# EAGLE design FeatherProto-V2.0 (EAGLE 7.4.0)
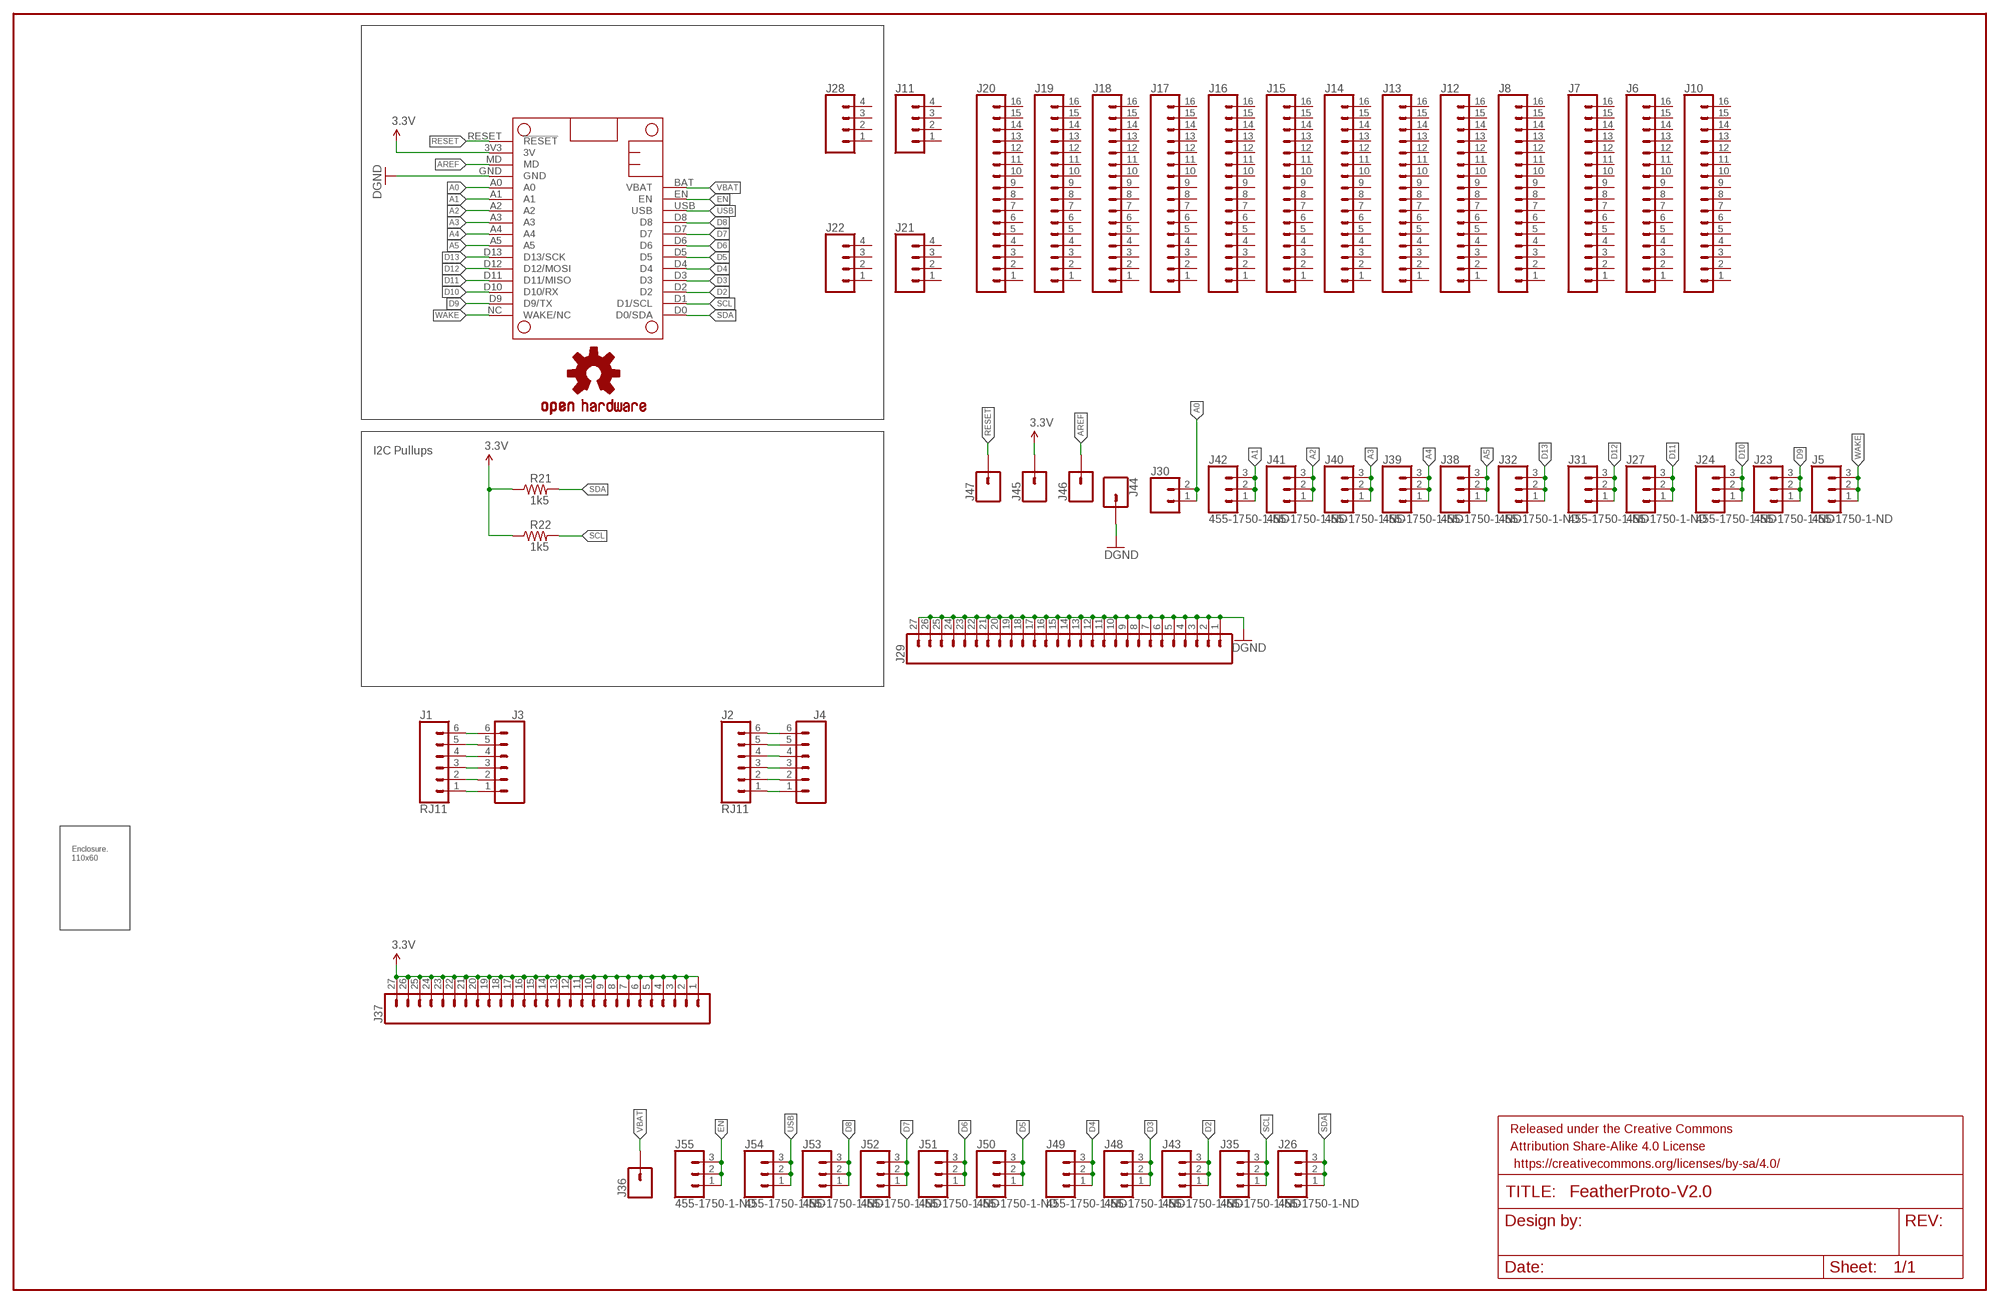
[diagram p0: schematic, sheet 1]

## Parts
FRAME2  FRAME-LEDGER  [CREATIVE_COMMONS]
J1  RJ11  RJ11-6  [RJ11-6]
J2  RJ11  RJ11-6  [RJ11-6]
J3  CONN_06SILK_FEMALE_PTH  [1X06]
J4  CONN_06SILK_FEMALE_PTH  [1X06]
J5  455-1750-1-ND  CONN_03  [1X03]
J6  CONN_161X16_NO_SILK  [1X16_NO_SILK]
J7  CONN_161X16_NO_SILK  [1X16_NO_SILK]
J8  CONN_161X16_NO_SILK  [1X16_NO_SILK]
J10  CONN_161X16_NO_SILK  [1X16_NO_SILK]
J11  CONN_041X04_NO_SILK  [1X04_NO_SILK]
J12  CONN_161X16_NO_SILK  [1X16_NO_SILK]
J13  CONN_161X16_NO_SILK  [1X16_NO_SILK]
J14  CONN_161X16_NO_SILK  [1X16_NO_SILK]
J15  CONN_161X16_NO_SILK  [1X16_NO_SILK]
J16  CONN_161X16_NO_SILK  [1X16_NO_SILK]
J17  CONN_161X16_NO_SILK  [1X16_NO_SILK]
J18  CONN_161X16_NO_SILK  [1X16_NO_SILK]
J19  CONN_161X16_NO_SILK  [1X16_NO_SILK]
J20  CONN_161X16_NO_SILK  [1X16_NO_SILK]
J21  CONN_041X04_NO_SILK  [1X04_NO_SILK]
J22  CONN_041X04_NO_SILK  [1X04_NO_SILK]
J23  455-1750-1-ND  CONN_03  [1X03]
J24  455-1750-1-ND  CONN_03  [1X03]
J26  455-1750-1-ND  CONN_03  [1X03]
J27  455-1750-1-ND  CONN_03  [1X03]
J28  CONN_041X04_NO_SILK  [1X04_NO_SILK]
J29  CONN_27  [1X27]
J30  CONN_02  [1X02]
J31  455-1750-1-ND  CONN_03  [1X03]
J32  455-1750-1-ND  CONN_03  [1X03]
J35  455-1750-1-ND  CONN_03  [1X03]
J36  CONN_01PTH_NO_SILK_YES_STOP  [1X01_NO_SILK]
J37  CONN_27  [1X27]
J38  455-1750-1-ND  CONN_03  [1X03]
J39  455-1750-1-ND  CONN_03  [1X03]
J40  455-1750-1-ND  CONN_03  [1X03]
J41  455-1750-1-ND  CONN_03  [1X03]
J42  455-1750-1-ND  CONN_03  [1X03]
J43  455-1750-1-ND  CONN_03  [1X03]
J44  CONN_01PTH_NO_SILK_YES_STOP  [1X01_NO_SILK]
J45  CONN_01PTH_NO_SILK_YES_STOP  [1X01_NO_SILK]
J46  CONN_01PTH_NO_SILK_YES_STOP  [1X01_NO_SILK]
J47  CONN_01PTH_NO_SILK_YES_STOP  [1X01_NO_SILK]
J48  455-1750-1-ND  CONN_03  [1X03]
J49  455-1750-1-ND  CONN_03  [1X03]
J50  455-1750-1-ND  CONN_03  [1X03]
J51  455-1750-1-ND  CONN_03  [1X03]
J52  455-1750-1-ND  CONN_03  [1X03]
J53  455-1750-1-ND  CONN_03  [1X03]
J54  455-1750-1-ND  CONN_03  [1X03]
J55  455-1750-1-ND  CONN_03  [1X03]
LOGO1  OSHW-LOGOM  [OSHW-LOGO-M]
MS1  XENONA  [XENON_BREAKOUT_A]
R21  1k5  RESISTOR0805  [0805]
R22  1k5  RESISTOR0805  [0805]
U$1  CAMDENBOSS-ENCLOSURE-110X60BOTH-EXTENDED-WIDE  [CAMDENBOSS_ENCLOSURE_110X60_WIDE_EXTENDED]

## Nets
3.3V: J37.1 J37.2 J37.3 J37.4 J37.5 J37.6 J37.7 J37.8 J37.9 J37.10 J37.11 J37.12 J37.13 J37.14 J37.15 J37.16 J37.17 J37.18 J37.19 J37.20 J37.21 J37.22 J37.23 J37.24 J37.25 J37.26 J37.27 J45.1 MS1.3V3(3V) R21.1 R22.1
A0: J30.1 J30.2 MS1.A0
A1: J42.1 J42.2 J42.3 MS1.A1
A2: J41.1 J41.2 J41.3 MS1.A2
A3: J40.1 J40.2 J40.3 MS1.A3
A4: J39.1 J39.2 J39.3 MS1.A4
A5: J38.1 J38.2 J38.3 MS1.A5
AREF: J46.1 MS1.MD
D2: J43.1 J43.2 J43.3 MS1.D2
D3: J48.1 J48.2 J48.3 MS1.D3
D4: J49.1 J49.2 J49.3 MS1.D4
D5: J50.1 J50.2 J50.3 MS1.D5
D6: J51.1 J51.2 J51.3 MS1.D6
D7: J52.1 J52.2 J52.3 MS1.D7
D8: J53.1 J53.2 J53.3 MS1.D8
D9: J23.1 J23.2 J23.3 MS1.D9(D9/TX)
D10: J24.1 J24.2 J24.3 MS1.D10(D10/RX)
D11: J27.1 J27.2 J27.3 MS1.D11(D11/MISO)
D12: J31.1 J31.2 J31.3 MS1.D12(D12/MOSI)
D13: J32.1 J32.2 J32.3 MS1.D13(D13/SCK)
EN: J55.1 J55.2 J55.3 MS1.EN
GND: J29.1 J29.2 J29.3 J29.4 J29.5 J29.6 J29.7 J29.8 J29.9 J29.10 J29.11 J29.12 J29.13 J29.14 J29.15 J29.16 J29.17 J29.18 J29.19 J29.20 J29.21 J29.22 J29.23 J29.24 J29.25 J29.26 J29.27 J44.1 MS1.GND ; supply symbol labelled DGND
N$1: J1.6 J3.6
N$3: J1.5 J3.5
N$4: J1.4 J3.4
N$6: J1.3 J3.3
N$7: J1.2 J3.2
N$11: J1.1 J3.1
N$12: J2.1 J4.1
N$13: J2.2 J4.2
N$15: J2.3 J4.3
N$16: J2.4 J4.4
N$19: J2.5 J4.5
N$20: J2.6 J4.6
RESET: J47.1 MS1.RESET(!RESET)
SCL: J35.1 J35.2 J35.3 MS1.D1(D1/SCL) R22.2
SDA: J26.1 J26.2 J26.3 MS1.D0(D0/SDA) R21.2
USB: J54.1 J54.2 J54.3 MS1.USB
VBAT: J36.1 MS1.BAT(VBAT)
WAKE: J5.1 J5.2 J5.3 MS1.NC(WAKE/NC)
Unconnected: J6.1 J6.2 J6.3 J6.4 J6.5 J6.6 J6.7 J6.8 J6.9 J6.10 J6.11 J6.12 J6.13 J6.14 J6.15 J6.16 J7.1 J7.2 J7.3 J7.4 J7.5 J7.6 J7.7 J7.8 J7.9 J7.10 J7.11 J7.12 J7.13 J7.14 J7.15 J7.16 J8.1 J8.2 J8.3 J8.4 J8.5 J8.6 J8.7 J8.8 J8.9 J8.10 J8.11 J8.12 J8.13 J8.14 J8.15 J8.16 J10.1 J10.2 J10.3 J10.4 J10.5 J10.6 J10.7 J10.8 J10.9 J10.10 J10.11 J10.12 J10.13 J10.14 J10.15 J10.16 J11.1 J11.2 J11.3 J11.4 J12.1 J12.2 J12.3 J12.4 J12.5 J12.6 J12.7 J12.8 J12.9 J12.10 J12.11 J12.12 J12.13 J12.14 J12.15 J12.16 J13.1 J13.2 J13.3 J13.4 J13.5 J13.6 J13.7 J13.8 J13.9 J13.10 J13.11 J13.12 J13.13 J13.14 J13.15 J13.16 J14.1 J14.2 J14.3 J14.4 J14.5 J14.6 J14.7 J14.8 J14.9 J14.10 J14.11 J14.12 J14.13 J14.14 J14.15 J14.16 J15.1 J15.2 J15.3 J15.4 J15.5 J15.6 J15.7 J15.8 J15.9 J15.10 J15.11 J15.12 J15.13 J15.14 J15.15 J15.16 J16.1 J16.2 J16.3 J16.4 J16.5 J16.6 J16.7 J16.8 J16.9 J16.10 J16.11 J16.12 J16.13 J16.14 J16.15 J16.16 J17.1 J17.2 J17.3 J17.4 J17.5 J17.6 J17.7 J17.8 J17.9 J17.10 J17.11 J17.12 J17.13 J17.14 J17.15 J17.16 J18.1 J18.2 J18.3 J18.4 J18.5 J18.6 J18.7 J18.8 J18.9 J18.10 J18.11 J18.12 J18.13 J18.14 J18.15 J18.16 J19.1 J19.2 J19.3 J19.4 J19.5 J19.6 J19.7 J19.8 J19.9 J19.10 J19.11 J19.12 J19.13 J19.14 J19.15 J19.16 J20.1 J20.2 J20.3 J20.4 J20.5 J20.6 J20.7 J20.8 J20.9 J20.10 J20.11 J20.12 J20.13 J20.14 J20.15 J20.16 J21.1 J21.2 J21.3 J21.4 J22.1 J22.2 J22.3 J22.4 J28.1 J28.2 J28.3 J28.4

## Notes on the sheet
- I2C Pullups

## Library data of the parts
FRAME2 = SparkFun-Aesthetics:FRAME-LEDGER: Schematic Frame Standard 11x14 US Ledger frame
J1 J2 = SparkFun-Connectors:RJ11-6: RJ11 Jack - 6 pin Commonly found on CAT3 devices and some Microchip programmers. Here is the connector we sell at SparkFun: RJ11 6-Pin Connector <https://www.sparkfun.com/products/132> (PRT-00132) Datasheet <http://www.sparkfun.com/datasheets/Prototyping/Connectors/RJ11-Datasheet.pdf> It is used on this SparkFun product: SparkFun Weather Shield <https://www.sparkfun.com/products/12081> (DEV-12081) Weather Meters <https://www.sparkfun.com/products/8942> (SEN-08942); PROD_ID: CONN-08590; SF_ID: PRT-00132
J3 J4 = SparkFun-Connectors:CONN_06: Multi connection point. Often used as Generic Header-pin footprint for 0.1 inch spaced/style header connections On any of the 0.1 inch spaced packages, you can populate with these: Break Away Headers - Straight <https://www.sparkfun.com/products/116> (PRT-00116) Break Away Male Headers - Right Angle <https://www.sparkfun.com/products/553> (PRT-00553) Female Headers <https://www.sparkfun.com/products/115> (PRT-00115) Break Away Headers - Machine Pin <https://www.sparkfun.com/products/117> (PRT-00117) Break Away Female Headers - Swiss Machine Pin <https://www.sparkfun.com/products/743> (PRT-00743) Arduino Stackable Header - 6 Pin <https://www.sparkfun.com/products/9280> (PRT-09280) For SCREWTERMINALS and SPRING TERMINALS visit here: Screw Terimnals on SparkFun.com <https://www.sparkfun.com/search/results?term=Screw+Terminals> (5mm/3.5mm/2.54mm spacing) This device is also useful as a general connection point to wire up your design to another part of your project. Our various solder wires solder well into these plated through hole pads. Hook-Up Wire - Assortment (Stranded, 22 AWG) <https://www.sparkfun.com/products/11375> (PRT-11375) Hook-Up Wire - Assortment (Solid Core, 22 AWG) <https://www.sparkfun.com/products/11367> (PRT-11367) View the entire wire category on our website here <https://www.sparkfun.com/categories/141>; PROD_ID: CONN-08437
J5 J23 J24 J26 J27 J31 J32 J35 J38-J43 J48-J55 = SparkFun-Connectors:CONN_03: Multi connection point. Often used as Generic Header-pin footprint for 0.1 inch spaced/style header connections On any of the 0.1 inch spaced packages, you can populate with these: Break Away Headers - Straight <https://www.sparkfun.com/products/116> (PRT-00116) Break Away Male Headers - Right Angle <https://www.sparkfun.com/products/553> (PRT-00553) Female Headers <https://www.sparkfun.com/products/115> (PRT-00115) Break Away Headers - Machine Pin <https://www.sparkfun.com/products/117> (PRT-00117) Break Away Female Headers - Swiss Machine Pin <https://www.sparkfun.com/products/743> (PRT-00743) Stackable Header - 3 Pin (Female, 0.1") <https://www.sparkfun.com/products/13875> (PRT-13875) For SCREWTERMINALS and SPRING TERMINALS visit here: Screw Terimnals on SparkFun.com <https://www.sparkfun.com/search/results?term=Screw+Terminals> (5mm/3.5mm/2.54mm spacing) This device is also useful as a general connection point to wire up your design to another part of your project. Our various solder wires solder well into these plated through hole pads. Hook-Up Wire - Assortment (Stranded, 22 AWG) <https://www.sparkfun.com/products/11375> (PRT-11375) Hook-Up Wire - Assortment (Solid Core, 22 AWG) <https://www.sparkfun.com/products/11367> (PRT-11367) View the entire wire category on our website here <https://www.sparkfun.com/categories/141> Special notes: Molex polarized connector foot print use with SKU : PRT-08232 with associated crimp pins and housings.; PROD_ID: XXX-00000
J6-J8 J10 J12-J20 = SparkFun-Connectors:CONN_16: Multi connection point. Often used as Generic Header-pin footprint for 0.1 inch spaced/style header connections On any of the 0.1 inch spaced packages, you can populate with these: Break Away Headers - Straight <https://www.sparkfun.com/products/116> (PRT-00116) Break Away Male Headers - Right Angle <https://www.sparkfun.com/products/553> (PRT-00553) Female Headers <https://www.sparkfun.com/products/115> (PRT-00115) Break Away Headers - Machine Pin <https://www.sparkfun.com/products/117> (PRT-00117) Break Away Female Headers - Swiss Machine Pin <https://www.sparkfun.com/products/743> (PRT-00743) For SCREWTERMINALS and SPRING TERMINALS visit here: Screw Terimnals on SparkFun.com <https://www.sparkfun.com/search/results?term=Screw+Terminals> (5mm/3.5mm/2.54mm spacing) This device is also useful as a general connection point to wire up your design to another part of your project. Our various solder wires solder well into these plated through hole pads. Hook-Up Wire - Assortment (Stranded, 22 AWG) <https://www.sparkfun.com/products/11375> (PRT-11375) Hook-Up Wire - Assortment (Solid Core, 22 AWG) <https://www.sparkfun.com/products/11367> (PRT-11367) View the entire wire category on our website here <https://www.sparkfun.com/categories/141> Special notes: Molex polarized connector foot print use with SKU : PRT-08231 with associated crimp pins and housings. 1MM SMD Version SKU: PRT-10208 NOTES ON THE VARIANTS LOCK and LOCK_LONGPADS... This footprint was designed to help hold the alignment of a through-hole component (i.e. 6-pin header) while soldering it into place. You may notice that each hole has been shifted either up or down by 0.005 of an inch from it's more standard position (which is a perfectly straight line). This slight alteration caused the pins (the squares in the middle) to touch the edges of the holes. Because they are alternating, it causes a "brace" to hold the component in place. 0.005 has proven to be the perfect amount of "off-center" position when using our standard breakaway headers. Although looks a little odd when you look at the bare footprint, once you have a header in there, the alteration is very hard to notice. Also,if you push a header all the way into place, it is covered up entirely on the bottom side.
J11 J21 J22 J28 = SparkFun-Connectors:CONN_04: Multi connection point. Often used as Generic Header-pin footprint for 0.1 inch spaced/style header connections On any of the 0.1 inch spaced packages, you can populate with these: Break Away Headers - Straight <https://www.sparkfun.com/products/116> (PRT-00116) Break Away Male Headers - Right Angle <https://www.sparkfun.com/products/553> (PRT-00553) Female Headers <https://www.sparkfun.com/products/115> (PRT-00115) Break Away Headers - Machine Pin <https://www.sparkfun.com/products/117> (PRT-00117) Break Away Female Headers - Swiss Machine Pin <https://www.sparkfun.com/products/743> (PRT-00743) For SCREWTERMINALS and SPRING TERMINALS visit here: Screw Terimnals on SparkFun.com <https://www.sparkfun.com/search/results?term=Screw+Terminals> (5mm/3.5mm/2.54mm spacing) This device is also useful as a general connection point to wire up your design to another part of your project. Our various solder wires solder well into these plated through hole pads. Hook-Up Wire - Assortment (Stranded, 22 AWG) <https://www.sparkfun.com/products/11375> (PRT-11375) Hook-Up Wire - Assortment (Solid Core, 22 AWG) <https://www.sparkfun.com/products/11367> (PRT-11367) View the entire wire category on our website here <https://www.sparkfun.com/categories/141> Special notes: Molex polarized connector foot print use with SKU : PRT-08231 with associated crimp pins and housings. 1MM SMD Version SKU: PRT-10208; PROD_ID: CONN-09696
J29 J37 = SparkFun-Connectors:CONN_27: Multi connection point. Often used as Generic Header-pin footprint for 0.1 inch spaced/style header connections On any of the 0.1 inch spaced packages, you can populate with these: Break Away Headers - Straight <https://www.sparkfun.com/products/116> (PRT-00116) Break Away Male Headers - Right Angle <https://www.sparkfun.com/products/553> (PRT-00553) Female Headers <https://www.sparkfun.com/products/115> (PRT-00115) Break Away Headers - Machine Pin <https://www.sparkfun.com/products/117> (PRT-00117) Break Away Female Headers - Swiss Machine Pin <https://www.sparkfun.com/products/743> (PRT-00743) For SCREWTERMINALS and SPRING TERMINALS visit here: Screw Terimnals on SparkFun.com <https://www.sparkfun.com/search/results?term=Screw+Terminals> (5mm/3.5mm/2.54mm spacing) This device is also useful as a general connection point to wire up your design to another part of your project. Our various solder wires solder well into these plated through hole pads. Hook-Up Wire - Assortment (Stranded, 22 AWG) <https://www.sparkfun.com/products/11375> (PRT-11375) Hook-Up Wire - Assortment (Solid Core, 22 AWG) <https://www.sparkfun.com/products/11367> (PRT-11367) View the entire wire category on our website here <https://www.sparkfun.com/categories/141> Special notes: Molex polarized connector foot print use with SKU : PRT-08231 with associated crimp pins and housings. 1MM SMD Version SKU: PRT-10208 NOTES ON THE VARIANTS LOCK and LOCK_LONGPADS... This footprint was designed to help hold the alignment of a through-hole component (i.e. 6-pin header) while soldering it into place. You may notice that each hole has been shifted either up or down by 0.005 of an inch from it's more standard position (which is a perfectly straight line). This slight alteration caused the pins (the squares in the middle) to touch the edges of the holes. Because they are alternating, it causes a "brace" to hold the component in place. 0.005 has proven to be the perfect amount of "off-center" position when using our standard breakaway headers. Although looks a little odd when you look at the bare footprint, once you have a header in there, the alteration is very hard to notice. Also,if you push a header all the way into place, it is covered up entirely on the bottom side.
J30 = SparkFun-Connectors:CONN_02: Multi connection point. Often used as Generic Header-pin footprint for 0.1 inch spaced/style header connections On any of the 0.1 inch spaced packages, you can populate with these: Break Away Headers - Straight <https://www.sparkfun.com/products/116> (PRT-00116) Break Away Male Headers - Right Angle <https://www.sparkfun.com/products/553> (PRT-00553) Female Headers <https://www.sparkfun.com/products/115> (PRT-00115) Break Away Headers - Machine Pin <https://www.sparkfun.com/products/117> (PRT-00117) Break Away Female Headers - Swiss Machine Pin <https://www.sparkfun.com/products/743> (PRT-00743) For SCREWTERMINALS and SPRING TERMINALS visit here: Screw Terimnals on SparkFun.com <https://www.sparkfun.com/search/results?term=Screw+Terminals> (5mm/3.5mm/2.54mm spacing) This device is also useful as a general connection point to wire up your design to another part of your project. Our various solder wires solder well into these plated through hole pads. Hook-Up Wire - Assortment (Stranded, 22 AWG) <https://www.sparkfun.com/products/11375> (PRT-11375) Hook-Up Wire - Assortment (Solid Core, 22 AWG) <https://www.sparkfun.com/products/11367> (PRT-11367) View the entire wire category on our website here <https://www.sparkfun.com/categories/141> Special notes: Molex polarized connector foot print use with: PRT-08233 with associated crimp pins and housings. 2.54_SCREWTERM for use with PRT-10571. 3.5mm Screw Terminal footprints for PRT-08084 5mm Screw Terminal footprints for use with PRT-08432
J36 J44-J47 = SparkFun-Connectors:CONN_01: Single connection point. Often used as Generic Header-pin footprint for 0.1 inch spaced/style header connections On any of the 0.1 inch spaced packages, you can populate with these: Break Away Headers - Straight <https://www.sparkfun.com/products/116> (PRT-00116) Break Away Male Headers - Right Angle <https://www.sparkfun.com/products/553> (PRT-00553) Female Headers <https://www.sparkfun.com/products/115> (PRT-00115) Break Away Headers - Machine Pin <https://www.sparkfun.com/products/117> (PRT-00117) Break Away Female Headers - Swiss Machine Pin <https://www.sparkfun.com/products/743> (PRT-00743) This device is also useful as a general connection point to wire up your design to another part of your project. Our various solder wires solder well into these plated through hole pads. Hook-Up Wire - Assortment (Stranded, 22 AWG) <https://www.sparkfun.com/products/11375> (PRT-11375) Hook-Up Wire - Assortment (Solid Core, 22 AWG) <https://www.sparkfun.com/products/11367> (PRT-11367) View the entire wire category on our website here <https://www.sparkfun.com/categories/141> Special notes: SMTSO-256-ET is a "flush mount" nut for a 4-40 screw. We mostly use this on specialty testbeds; it is a nice way to connect hardware to your PCB at an adjustable hieght. Also note, the SNAP packages are for using a snappable style connector. We sell a baggie of snaps and they are also used on two LilyPad designs: Snap Assortment - 30 pack (male and female) <https://www.sparkfun.com/products/11347> (DEV-11347) LilyPad Arduino SimpleSnap <https://www.sparkfun.com/products/10941> (DEV-10941) LilyPad SimpleSnap Protoboard <https://www.sparkfun.com/products/10940> (DEV-10940)
LOGO1 = SparkFun-Aesthetics:OSHW-LOGO: Open Source Hardware Logo This logo indicates the piece of hardware it is found on incorporates a OSHW license and/or adheres to the definition of open source hardware found here: http://freedomdefined.org/OSHW
MS1 = ThingySticks:XENON
R21 R22 = SparkFun-Resistors:RESISTOR: Generic Resistor Package
U$1 = ThingySticks:CAMDENBOSS-ENCLOSURE-110X60

## Board
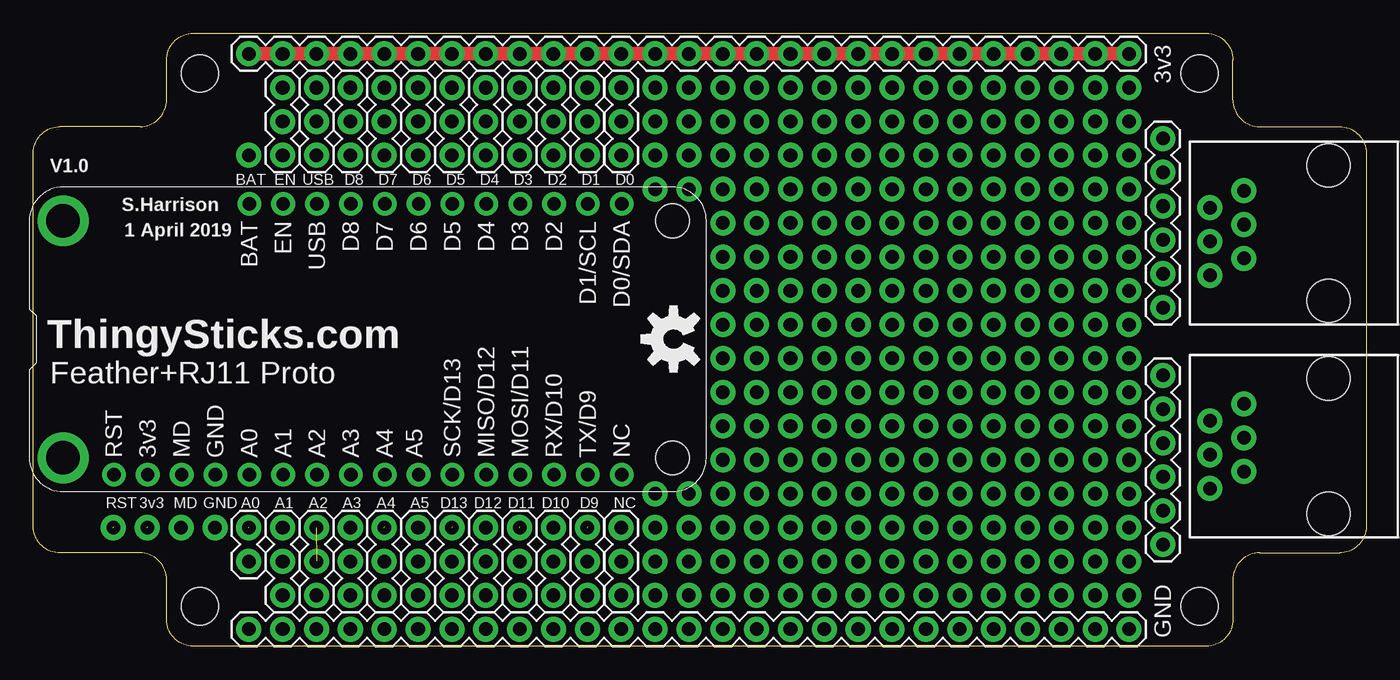
[diagram p1: board, top side]
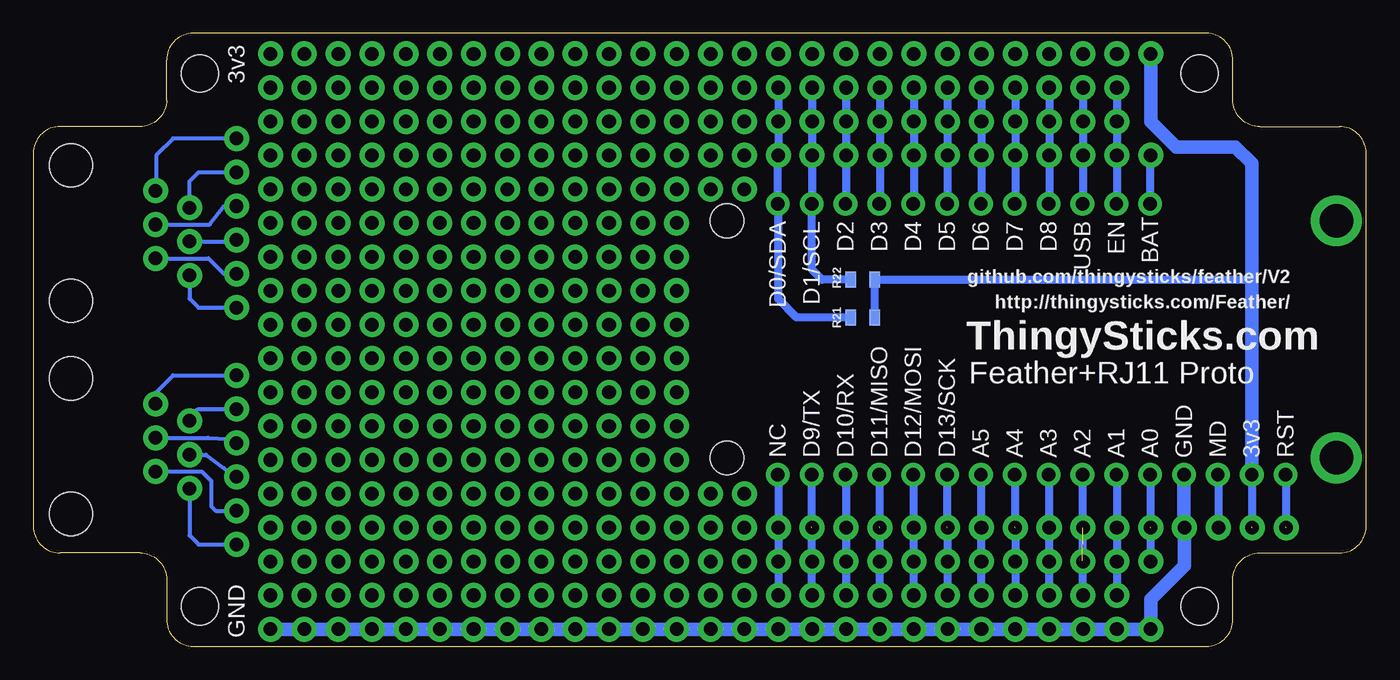
[diagram p2: board, bottom side, seen from below]

Size 100 x 46 mm. Coordinates in mm from the lower left corner, seen from the top.
Copper layers (1*16): Top 0.035mm / dielectric 1.5mm / Bottom 0.035mm
Design rules "dirt_cheap_dirty_boards.v1.1": minimum track width 6mil, minimum drill 12mil, track to track 6mil, track to pad 6mil, pad to pad 6mil, via to via 6mil, smd to smd 0mil, copper to edge 10mil, drill to drill 10mil, minimum pad ring 10mil, minimum via ring 6mil, stop-mask expansion 2mil, vias tented up to drill 25mil, thermal gap 10mil
tRestrict: area 10.5,41 to 14.5,45; area 10.5,1 to 14.5,5; area 85.5,1 to 89.5,5; area 85.5,41 to 89.5,45

### Footprints (pad centres in the part's own frame; a part is rotated, then mirrored left to right if it is on the bottom)
RJ11-6 = drill 1.016 pad 1.88: 1 -3.175,8.89; 2 -1.905,6.35; 3 -0.635,8.89; 4 0.635,6.35; 5 1.905,8.89; 6 3.175,6.35 | hole 3.251: -5.08,0; 5.08,0
1X06 = drill 1.016 pad 1.88: 1 0,0; 2 2.54,0; 3 5.08,0; 4 7.62,0; 5 10.16,0; 6 12.7,0
1X03 = drill 1.016 pad 1.88: 1 0,0; 2 2.54,0; 3 5.08,0
1X16_NO_SILK = drill 1.016 pad 1.88: 1 0,0; 2 2.54,0; 3 5.08,0; 4 7.62,0; 5 10.16,0; 6 12.7,0; 7 15.24,0; 8 17.78,0; 9 20.32,0; 10 22.86,0; 11 25.4,0; 12 27.94,0; 13 30.48,0; 14 33.02,0; 15 35.56,0; 16 38.1,0
1X04_NO_SILK = drill 1.016 pad 1.88: 1 0,0; 2 2.54,0; 3 5.08,0; 4 7.62,0
1X27 = drill 1.016 pad 1.88: 1 0,0; 2 2.54,0; 3 5.08,0; 4 7.62,0; 5 10.16,0; 6 12.7,0; 7 15.24,0; 8 17.78,0; 9 20.32,0; 10 22.86,0; 11 25.4,0; 12 27.94,0; 13 30.48,0; 14 33.02,0; 15 35.56,0; 16 38.1,0; 17 40.64,0; 18 43.18,0; 19 45.72,0; 20 48.26,0; 21 50.8,0; 22 53.34,0; 23 55.88,0; 24 58.42,0; 25 60.96,0; 26 63.5,0; 27 66.04,0
1X02 = drill 1.016 pad 1.88: 1 0,0; 2 2.54,0
1X01_NO_SILK = drill 1.016 pad 1.88: 1 0,0
XENON_BREAKOUT_A = drill 1 pad 1.778: 3V3 8.89,1.27; A0 16.51,1.27; A1 19.05,1.27; A2 21.59,1.27; A3 24.13,1.27; A4 26.67,1.27; A5 29.21,1.27; BAT 16.51,21.59; D0 44.45,21.59; D1 41.91,21.59; D2 39.37,21.59; D3 36.83,21.59; D4 34.29,21.59; D5 31.75,21.59; D6 29.21,21.59; D7 26.67,21.59; D8 24.13,21.59; D9 41.91,1.27; D10 39.37,1.27; D11 36.83,1.27; D12 34.29,1.27; D13 31.75,1.27; EN 19.05,21.59; GND 13.97,1.27; MD 11.43,1.27; NC 44.45,1.27; RESET 6.35,1.27; USB 21.59,21.59 | drill 2.5 pad 3.81: P$1 2.54,20.32; P$2 2.54,2.54 | hole 2.54: 48.26,20.32; 48.26,2.54
0805 = smd 0.8 x 1.2: 1 -0.9,0; 2 0.9,0
CAMDENBOSS_ENCLOSURE_110X60_WIDE_EXTENDED = hole 2.8: 43,2.5; 43,77.5; 3,77.5; 3,2.5

### Placement (x,y rotation side)
FRAME2  16.52,-14.12 0 top  (outside the outline)
J1  97.17,31.01 90 top
J2  97.17,15.01 90 top
J3  84.75,25.41 90 top
J4  84.75,7.63 90 top
J5  44.11,3.82 90 top
J6  77.13,41.92 270 top
J7  74.59,41.92 270 top
J8  79.67,41.92 270 top
J10  82.21,41.92 270 top
J11  49.19,34.3 90 top
J12  72.05,41.92 270 top
J13  69.51,41.92 270 top
J14  66.97,41.92 270 top
J15  64.43,41.92 270 top
J16  61.89,41.92 270 top
J17  59.35,41.92 270 top
J18  56.81,41.92 270 top
J19  54.27,41.92 270 top
J20  51.73,41.92 270 top
J21  49.19,3.82 90 top
J22  46.65,3.82 90 top
J23  41.57,3.82 90 top
J24  39.03,3.82 90 top
J26  44.11,36.84 90 top
J27  36.49,3.82 90 top
J28  46.65,34.3 90 top
J29  16.17,1.28 0 top
J30  16.17,6.36 90 top
J31  33.95,3.82 90 top
J32  31.41,3.82 90 top
J35  41.57,36.84 90 top
J36  16.17,36.84 0 top
J37  16.17,44.46 0 top
J38  28.87,3.82 90 top
J39  26.33,3.82 90 top
J40  23.79,3.82 90 top
J41  21.25,3.82 90 top
J42  18.71,3.82 90 top
J43  39.03,36.84 90 top
J44  13.63,8.9 0 top
J45  8.55,8.9 0 top
J46  11.09,8.9 0 top
J47  6.01,8.9 0 top
J48  36.49,36.84 90 top
J49  33.95,36.84 90 top
J50  31.41,36.84 90 top
J51  28.87,36.84 90 top
J52  26.33,36.84 90 top
J53  23.79,36.84 90 top
J54  21.25,36.84 90 top
J55  18.71,36.84 90 top
LOGO1  48.03,23.05 90 top
MS1  -0.3,11.6 0 top
R21  37.77,24.69 180 bottom
R22  37.77,27.52 180 bottom
U$1  90,0 90 top

### Tracks (layer width: path | path; a pad name or v marks a point on that pad's centre or on a via)
3.3V  (1 unrouted)
  Top 1.016: J37.1 J37.2 J37.3 J37.4 J37.5 J37.6 J37.7 J37.8 J37.9 J37.10 J37.11 J37.12 J37.13 J37.14 J37.15 J37.16 J37.17 J37.18 J37.19 J37.20 J37.21 J37.22 J37.23 J37.24 J37.25 J37.26 J37.27
  Bottom 0.61: R21.1 R22.1 9.02,27.52 8.59,27.95 | MS1.3V3 8.59,8.94
  Bottom 1.016: MS1.3V3 8.59,27.95 8.59,36.24 9.82,37.48 14.26,37.48 16.17,39.38 J37.1
A0  (1 unrouted)
  Bottom 0.61: MS1.A0 16.21,8.94 | J30.1 J30.2
A1
  Bottom 0.61: MS1.A1 18.71,12.83 J42.3 J42.2 J42.1
A2  (1 unrouted)
  Bottom 0.61: MS1.A2 21.29,6.4 | 21.29,6.4 J41.2 | 21.29,6.4 21.29,3.86 J41.1
A3
  Bottom 0.61: J40.1 J40.2 J40.3 23.79,12.83 MS1.A3
A4  (1 unrouted)
  Bottom 0.61: MS1.A4 26.37,8.94 | J39.3 J39.2 J39.1
A5
  Bottom 0.61: J38.1 J38.2 J38.3 28.87,12.83 MS1.A5
AREF
  Bottom 0.61: MS1.MD 11.09,12.83 J46.1
D2
  Bottom 0.61: J43.2 J43.3 J43.1 39.03,33.23 MS1.D2
D3
  Bottom 0.61: J48.2 J48.3 J48.1 36.49,33.23 MS1.D3
D4
  Bottom 0.61: J49.3 J49.2 J49.1 33.95,33.23 MS1.D4
D5
  Bottom 0.61: J50.3 J50.2 J50.1 31.41,33.23 MS1.D5
D6
  Bottom 0.61: J51.3 J51.2 J51.1 28.87,33.23 MS1.D6
D7
  Bottom 0.61: J52.3 J52.2 J52.1 26.33,33.23 MS1.D7
D8
  Bottom 0.61: J53.3 J53.2 J53.1 23.79,33.23 MS1.D8
D9  (1 unrouted)
  Bottom 0.61: MS1.D9 41.61,8.94 | J23.1 J23.2 J23.3
D10
  Bottom 0.61: MS1.D10 39.03,12.83 J24.3 J24.2 J24.1
D11  (1 unrouted)
  Bottom 0.61: MS1.D11 36.53,8.94 | J27.1 J27.2 J27.3
D12
  Bottom 0.61: J31.1 J31.2 J31.3 33.95,12.83 MS1.D12
D13  (1 unrouted)
  Bottom 0.61: MS1.D13 31.45,8.94 | J32.3 J32.2 J32.1
EN
  Bottom 0.61: J55.3 J55.2 J55.1 18.71,33.23 MS1.EN
GND
  Bottom 1.016: MS1.GND 13.67,9.54 | 13.67,9.54 13.67,8.94 | J29.27 J29.26 J29.25 J29.24 J29.23 J29.22 J29.21 J29.20 J29.19 J29.18 J29.17 J29.16 J29.15 J29.14 J29.13 J29.12 J29.11 J29.10 J29.9 J29.8 J29.7 J29.6 J29.5 J29.4 J29.3 J29.2 J29.1 16.17,3.5 13.63,6.04 J44.1 13.63,9.49 13.67,9.54
N$1
  Bottom 0.305: J3.6 89.51,38.11 90.78,36.84 90.78,34.23 J1.6
N$3
  Bottom 0.305: J1.5 88.28,34.89 87.6,35.57 J3.5
N$4
  Bottom 0.305: J1.4 86.77,31.65 85.7,33.03 J3.4
N$6
  Bottom 0.305: J1.3 85.58,30.38 85.06,30.49 J3.3
N$7
  Bottom 0.305: J1.2 86.85,29.11 85.7,27.95 J3.2
N$11
  Bottom 0.305: J1.1 88.28,26.09 87.6,25.41 J3.1
N$12
  Bottom 0.305: J2.1 88.28,8.31 87.6,7.63 J4.1
N$13
  Bottom 0.305: J2.2 87.36,13.11 86.65,12.39 86.65,10.49 86.33,10.17 J4.2
N$15
  Bottom 0.305: J2.3 87.05,14.38 85.7,13.35 J4.3
N$16
  Bottom 0.305: J2.4 86.89,15.64 85.38,15.57 J4.4
N$19
  Bottom 0.305: J2.5 88.28,17.43 87.6,17.79 J4.5
N$20
  Bottom 0.305: J2.6 90.82,19.02 89.51,20.33 J4.6
RESET  (1 unrouted)
  Bottom 0.61: MS1.RESET 6.05,8.94
SCL
  Bottom 0.61: R22.2 40.82,27.52 41.57,28.27 41.57,33.15 MS1.D1 41.57,33.23 J35.3 J35.2 J35.1
SDA
  Bottom 0.61: R21.2 42.75,24.69 44.11,26.05 44.11,33.15 MS1.D0 44.15,36.8 J26.1 J26.2 J26.3
USB
  Bottom 0.61: J54.3 J54.2 J54.1 21.25,33.23 MS1.USB
VBAT
  Bottom 0.61: MS1.BAT 16.21,36.8 J36.1
WAKE
  Bottom 0.61: MS1.NC 44.11,12.83 J5.3 J5.2 J5.1

### Text on the board
tNames: 3v3 | V1.0 | S.Harrison | 1 April 2019 | ThingySticks.com | Feather+RJ11 Proto | GND
bNames: 3v3 | github.com/thingysticks/feather/V2 | http://thingysticks.com/Feather/ | ThingySticks.com | Feather+RJ11 Proto | GND